# Altium schematic sheet Power.SchDoc
size A4; DocumentNumber: 2; SheetNumber: 2; SheetTotal: 7
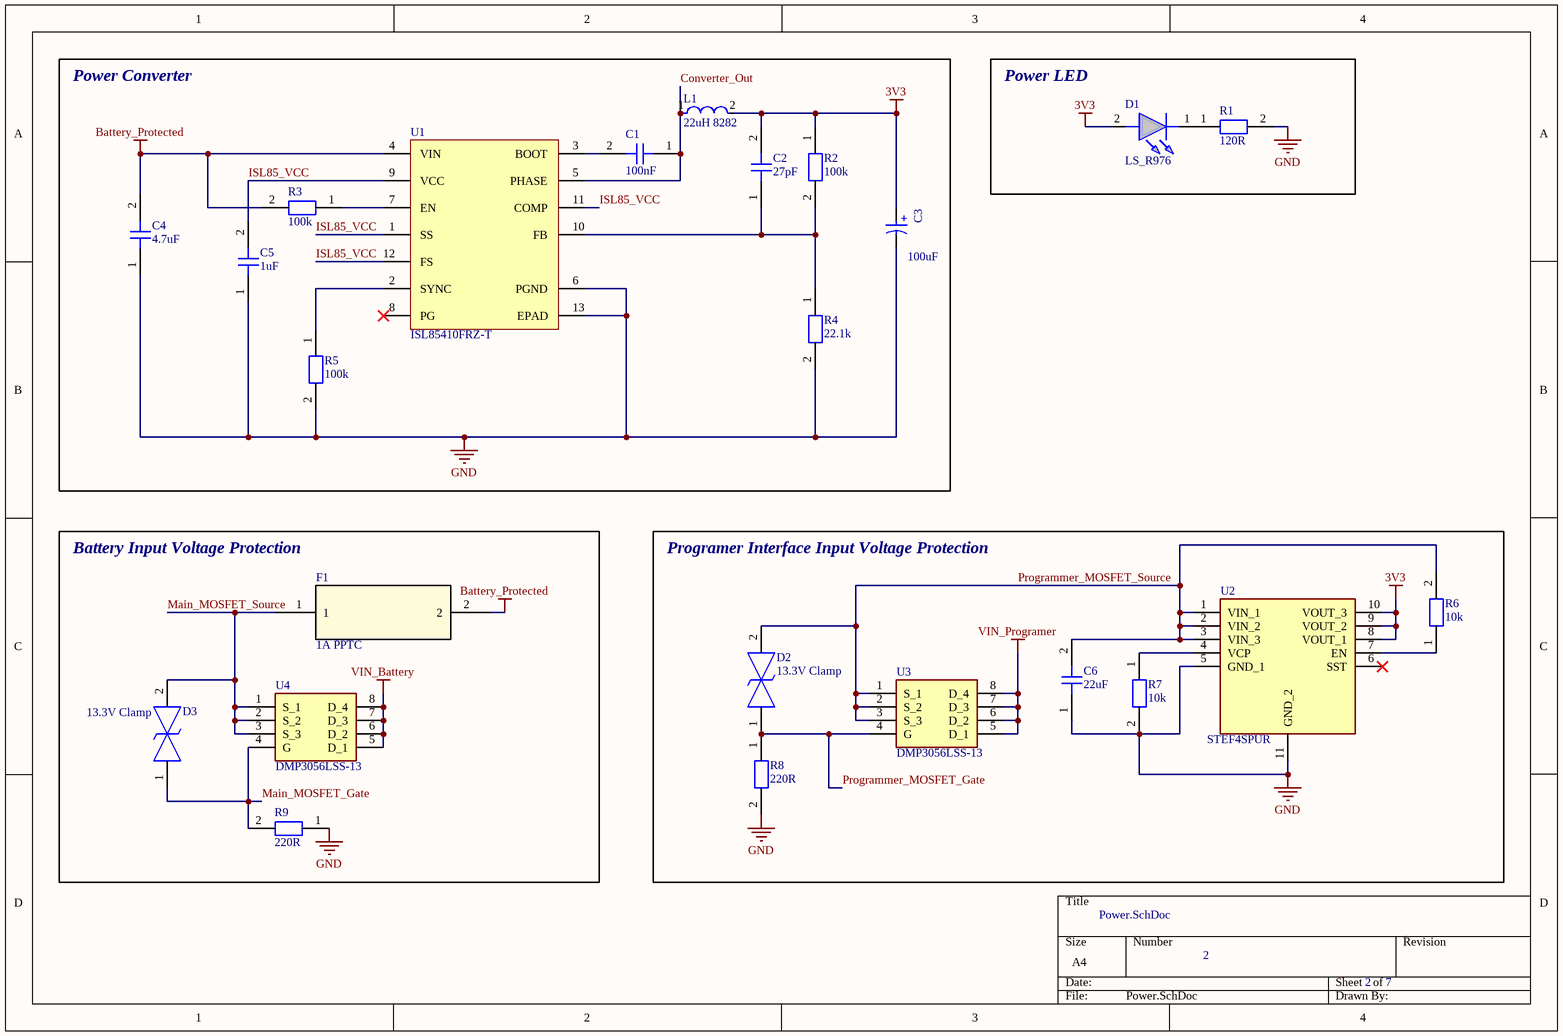
[diagram p0: Power.SchDoc]

## Parts
C1  100nF  [Cap_0603_Medium_Density]
C2  27pF  [Cap_0603_Medium_Density]
C3  100uF  [WCAP-ASLL_D6.3H5.5]
C4  4.7uF  [Cap_0603_Medium_Density]
C5  1uF  [Cap_0603_Medium_Density]
C6  22uF  [Cap_0603_Medium_Density]
D1  LS_R976  [LEDC2012X40N]
D2  13.3V Clamp  [DIONM5127X250N]
D3  13.3V Clamp  [DIONM5127X250N]
F1  1A PPTC  [CHIP_ 0603L_1P8X1_LTF]
L1  22uH 8282  [FP-IHLP-3232DZ-FP_2_413x5-MFG]
R1  120R  [Res_0603_Medium_Density]
R2  100k  [Res_0603_Medium_Density]
R3  100k  [Res_0603_Medium_Density]
R4  22.1k  [Res_0603_Medium_Density]
R5  100k  [Res_0603_Medium_Density]
R6  10k  [Res_0603_Medium_Density]
R7  10k  [Res_0603_Medium_Density]
R8  220R  [Res_0603_Medium_Density]
R9  220R  [Res_0603_Medium_Density]
U1  ISL85410FRZ-T  [L12_4x3_MFG]
U2  STEF4SPUR  [SON50P300X300X80-11N-D]
U3  DMP3056LSS-13  [SOIC127P600X170-8N]
U4  DMP3056LSS-13  [SOIC127P600X170-8N]

## Blocks framed on the sheet
Power Converter: C1-C5 L1 R2-R5 U1
Power LED: D1 R1
Battery Input Voltage Protection: D3 F1 R9 U4
Programer Interface Input Voltage Protection: C6 D2 R6-R8 U2 U3

## Nets
3V3: C2.2 C3.1(P) D1.2(A) L1.2 R2.1 U2.8(VOUT_1) U2.9(VOUT_2) U2.10(VOUT_3)
Battery_Protected: C4.2 F1.2 R3.2 U1.4(VIN)
GND: C3.2(N) C4.1 C5.1 C6.1 R1.2 R4.2 R5.2 R7.2 R8.2 R9.1 U1.6(PGND) U1.13(EPAD) U2.5(GND_1) U2.11(GND_2)
VIN_Battery: U4.5(D_1) U4.6(D_2) U4.7(D_3) U4.8(D_4)
VIN_Programer: U3.5(D_1) U3.6(D_2) U3.7(D_3) U3.8(D_4)
Converter_Out: C1.1 L1.1 U1.5(PHASE)
ISL85_VCC: C5.2 U1.1(SS) U1.9(VCC) U1.11(COMP) U1.12(FS)
Main_MOSFET_Gate: D3.1 R9.2 U4.4(G)
Main_MOSFET_Source: D3.2 F1.1 U4.1(S_1) U4.2(S_2) U4.3(S_3)
Programmer_MOSFET_Gate: D2.1 R8.1 U3.4(G)
Programmer_MOSFET_Source: C6.2 D2.2 R6.2 U2.1(VIN_1) U2.2(VIN_2) U2.3(VIN_3) U3.1(S_1) U3.2(S_2) U3.3(S_3)
NetC1_2: C1.2 U1.3(BOOT)
NetC2_1: C2.1 R2.2 R4.1 U1.10(FB)
NetD1_1: D1.1(K) R1.1
NetR3_1: R3.1 U1.7(EN)
NetR5_1: R5.1 U1.2(SYNC)
NetR6_1: R6.1 U2.7(EN)
NetR7_1: R7.1 U2.4(VCP)

Not connected (* = marked no-connect by the designer): U1 8(PG)*; U2 6(SST)*

## Notes on the sheet
- (in symbol CMP-03913-53914511-3) +

## Library data of the parts
C1 = Capacitor_MLLC: Part Number: CC0603KRX7R8BB104; Supplier: Mouser; ComponentLink1Description: Online Store Link; ComponentLink1URL: *; Manufacturer: *; Value: 100nF; Voltage: *; Package: 0603
C2 = Capacitor_MLLC: Part Number: CC0603JRNP09BN270; Supplier: Mouser; ComponentLink1Description: Online Store Link; ComponentLink1URL: *; Manufacturer: *; Value: 27pF; Voltage: *; Package: 0603
C3 = CMP-03913-53914511-3: WCAP-ASLL Aluminum Electrolytic Capacitors; Part Number: 865060343005; Life (Hours): 2000hours; Voltage Rating (DC): 16V; Ripple Current (AC): 255mA; Impedance: 440mΩ; ESR (Equivalent Series Resistance): 393.664mΩ; Insulation Resistance: 1MΩ; Leakage Current: 16µA; Capacitance: 100µF; Voltage Rating: 16V; Min Operating Temperature: -55°C; Ripple Current: 255mA; REACH SVHC: Unknown; Case/Package: Radial; Diameter: 6.3mm; Max Operating Temperature: 105°C; Packaging: Cut Tape; Length: 5.5mm; Height: 5.5mm; Supplier: Mouser; Value: 100uF
C4 = Capacitor_MLLC: Part Number: 06035U4R7JAT2A; Supplier: Mouser; ComponentLink1Description: Online Store Link; ComponentLink1URL: *; Manufacturer: *; Value: 4.7uF; Voltage: *; Package: 0603
C5 = Capacitor_MLLC: Part Number: CC0603KRX5R6BB105; Supplier: Mouser; ComponentLink1Description: Online Store Link; ComponentLink1URL: *; Manufacturer: *; Value: 1uF; Voltage: *; Package: 0603
C6 = Capacitor_MLLC: Part Number: CC0603MRX6S4BB226; Supplier: Mouser; ComponentLink1Description: Online Store Link; ComponentLink1URL: *; Manufacturer: *; Value: 22uF; Voltage: *; Package: 0603
D1 = LS_R976: Red 0805 CHIPLED LS R976N-R102 Osram Opto LS R976, CHIPLED 0805 Series Red LED, 633 nm, 2012 (0805), Rectangle Lens SMD Package; Manufacturer_Name: ams OSRAM; Manufacturer_Part_Number: LS R976; Geometry.Height: 0.4mm; Mouser Part Number: 720-LSR976D5178; Mouser Price/Stock: https://www.mouser.co.uk/ProductDetail/OSRAM-Opto-Semiconductors/LS-R976?qs=OIr7YF%252B2cWVTfzKl425Fkw%3D%3D; Datasheet Link: http://uk.rs-online.com/web/p/products/4974804; Part Number: LS R976; Supplier: Mouser
D2 D3 = SMAJ12CA-HP6AT_13: 19.9V Clamp 30.2A Ipp Tvs Diode Surface Mount DO-214AC (SMA); Manufacturer_Name: YAGEO; Manufacturer_Part_Number: SMAJ12CA-HP6AT/13; Geometry.Height: 2.5mm; Mouser Part Number: *; Mouser Price/Stock: *; Datasheet Link: https://www.yageo.com/upload/media/product/productsearch/datasheet/cpc/tvs/SMAJ-HP6AT_1.pdf; Part Number: SMAJ12CA-HP6AT/13; Supplier: Mouser
F1 = 0603L100SLYR: Description; Manufacturer_Name: Littelfuse Inc; Copyright: Copyright (C) 2025 Ultra Librarian. All rights reserved.; Manufacturer_Part_Number: 0603L100SLYR; RefDes: RefDes; Type: Type; Part Number: 0603L100SLYR; Supplier: Mouser
L1 = CMP-02424-000385-1: Commercial Inductors, High Temperature (155 °C) Series 22uH 3.7A 110.21mΩ 20%; Part Number: IHLP3232DZER220M51; Max DC Current: 3.8A; Self Resonant Frequency: 9MHz; Test Frequency: 100kHz; Shielding: Shielded; Length: 0.322inch; Inductance: 22uH; Package Quantity: 500; Military Standard: Not; Min Operating Temperature: -55°C; Lead Free: Lead Free; Packaging: Tape and Reel; Current Rating: 3.7A; Height: 4mm; Max Operating Temperature: 155°C; Width: 0.322inch; Tolerance: 20%; Case/Package: 3232; Saturation Current: 3.8A; Height - Seated (Max): 0.158inch; Mount: Surface Mount; Termination: SMD/SMT; Supplier: Mouser
R1 = Resistor_SMD: Part Number: CR0603-JW-121ELF; Value: 120R; Manufacturer: *; Supplier: Mouser; Voltage: *; ComponentLink1Description: Online Store Link; ComponentLink1URL: *; Package: 0603
R2 R3 R5 = Resistor_SMD: Part Number: AF0603FR-13100KL; Value: 100k; Manufacturer: *; Supplier: Mouser; Voltage: *; ComponentLink1Description: Online Store Link; ComponentLink1URL: *; Package: 0603
R4 = Resistor_SMD: Part Number: CRCW060322K1FKEBC; Value: 22.1k; Manufacturer: *; Supplier: Mouser; Voltage: *; ComponentLink1Description: Online Store Link; ComponentLink1URL: *; Package: 0603
R6 R7 = Resistor_SMD: Part Number: CR0603AFX-1002EAS; Value: 10k; Manufacturer: *; Supplier: Mouser; Voltage: *; ComponentLink1Description: Online Store Link; ComponentLink1URL: *; Package: 0603
R8 R9 = Resistor_SMD: Part Number: CR0603-JW-221ELF; Value: 220R; Manufacturer: *; Supplier: Mouser; Voltage: *; ComponentLink1Description: Online Store Link; ComponentLink1URL: *; Package: 0603
U1 = CMP-00572-88255842-3: Inverter RoHS Compliant Adjustable Positive Switching Regulator IC 125C 2MHz 1A 82.298666mg; Manufacturer Lifecycle Status: ACTIVE; Efficiency: 94%; RAM Size: 12kB; Max Supply Voltage: 40V; Topology: Buck; Min Output Voltage: 600mV; Max Junction Temperature (Tj): 125°C; Min Supply Voltage: 3V; Pitch: 500µm; Operating Supply Current: 4µA; Sync/Async: Synchronous; Max Output Voltage: 34V; Number of Outputs: 1; Synchronous Rectifier: Yes; Operating Supply Voltage: 36V; Quiescent Current: 80µA; HelpURL: https://octopart.com/cad-content/api/get-model-datasheet/15189/88255842; ComponentLink1URL: http://www.renesas.com; Switching Frequency: 2MHz; ComponentLink3URL: https://www.renesas.com/en/document/psc/l124x3-12-lead-dual-flat-no-lead-plastic-package?r=568491; Max Operating Temperature: 125°C; Export Control Classification Number (ECCN) Code: EAR99; Lead Free: Lead Free; ComponentLink2Description: Datasheet URL; Length: 4mm; Min Operating Temperature: -40°C; ComponentLink2URL: https://octopart.com/cad-content/api/get-model-datasheet/15189/88255842; ComponentLink1Description: Manufacturer's Website; Width: 3mm; Output Type: Adjustable; Max Output Current: 1A; Packaging: Tape & Reel; Case/Package: DFN; Mount: Surface Mount; Number of Pins: 12; Weight: 82.298666mg; Min Input Voltage: 3V; ComponentLink3Description: Manufacturer's Package Drawing; Max Input Voltage: 40V; Logic Function: Inverter; RoHS: Compliant; Output Current: 1A; Output Configuration: Positive; Lifecycle Status: Production; Height: 900µm; Output Voltage: 34V; Radiation Hardening: No; Part Number: ISL85410FRZ-T; Supplier: Mouser
U2 = STEF4SPUR: Hot Swap Voltage Controllers Electronic fuse 4V 3.6A 40mW 4.5V; Manufacturer_Name: STMicroelectronics; Geometry.Height: 0.8mm; Manufacturer_Part_Number: STEF4SPUR; Mouser Part Number: 511-STEF4SPUR; Mouser Price/Stock: https://www.mouser.co.uk/ProductDetail/STMicroelectronics/STEF4SPUR?qs=DqCdCwOw4%2F72PHOKVsUxjg%3D%3D; Datasheet Link: https://www.st.com/resource/en/datasheet/stef4s.pdf; Part Number: STEF4SPUR; Supplier: Mouser
U3 U4 = DMP3056LSS-13: MOSFET P Channel 30V 7.1A 2.1V @ 250uA 45m @ 6A,10V SOP-8_150mil RoHS; Manufacturer_Name: Diodes Incorporated; Geometry.Height: 1.7mm; Manufacturer_Part_Number: DMP3056LSS-13; Mouser Part Number: 621-DMP3056LSS-13; Mouser Price/Stock: https://www.mouser.co.uk/ProductDetail/Diodes-Incorporated/DMP3056LSS-13?qs=oUsD4qhOtFyEnPLZKitYRA%3D%3D; Datasheet Link: https://www.diodes.com//assets/Datasheets/ds31421.pdf; Part Number: DMP3056LSS-13; Supplier: Mouser